# EAGLE design KeepUntil-v1.0.1 (EAGLE 7.5.0)
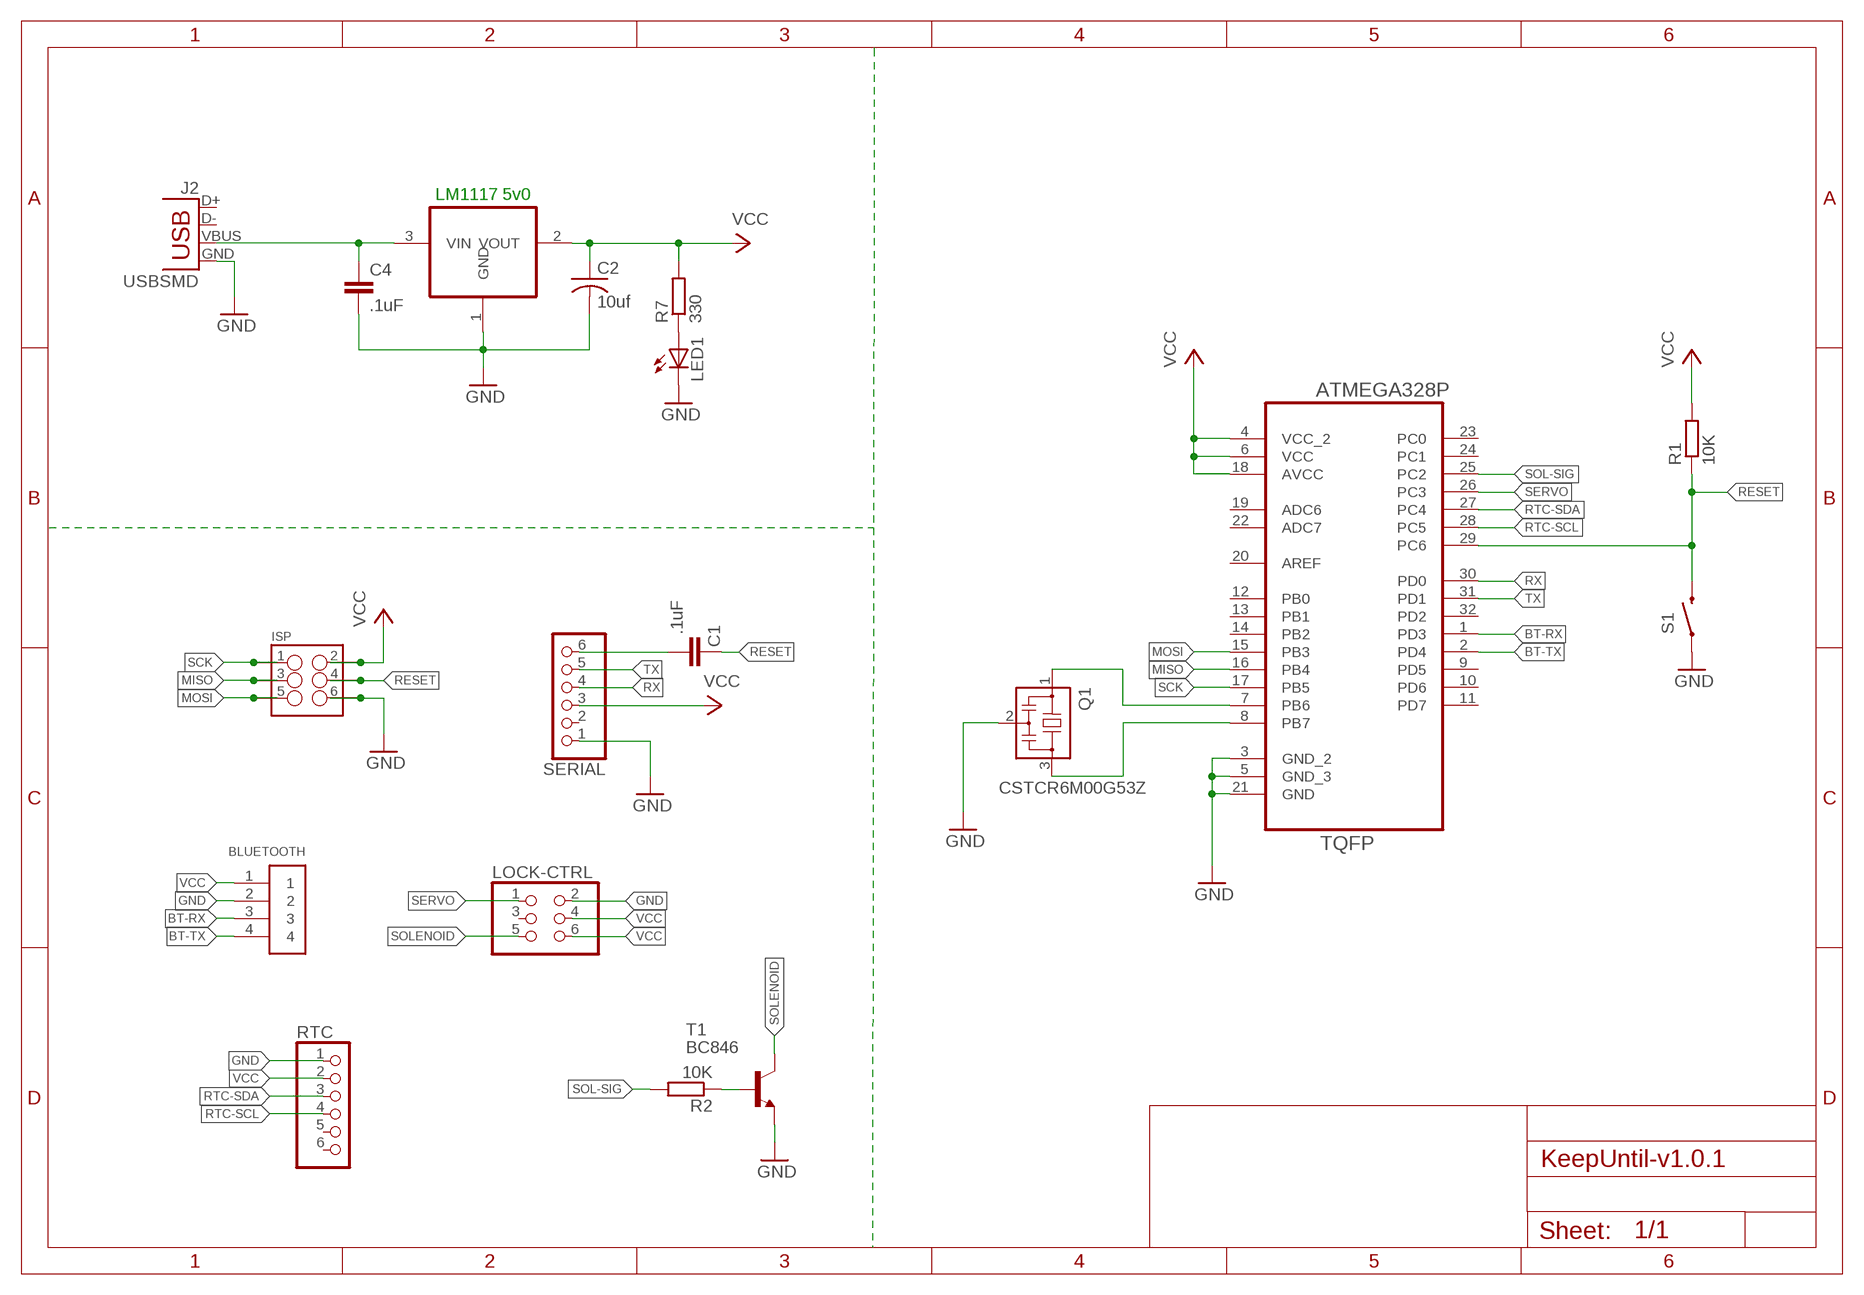
[diagram p0: schematic, sheet 1]

## Parts
BLUETOOTH  1X4-CLEANBIG  [1X04-CLEANBIG]
C1  .1uF  C-EUC0805  [C0805]
C2  10uf  C-USC1206  [C1206]
C4  .1uF  C-EUC0805  [C0805]
IC2  REG1117  [SOT223]
ISP  M03X2SHROUD  [2X3-SHROUDED]
J2  USBSMD  [USB-MINIB]
LED1  LEDSMT1206  [1206]
LOCK-CTRL  PINHD-2X3  [2X03]
Q1  CSTCR6M00G53Z  [CSTCR6M]
R1  10K  R-EU_R0805  [R0805]
R2  10K  R-EU_R0805  [R0805]
R7  330  R-EU_R0805  [R0805]
RTC  PINHD-1X6CLEAN  [1X06-CLEAN]
S1  SWITCH-MOMENTARY-2SMD-1101NE  [TACTILE-SWITCH-1101NE]
SERIAL  PINHD-1X6CLEAN  [1X06-CLEAN]
T1  BC846  [SOT23]
U1  ATMEGA328P-AU  [QFP80P900X900X120-32N]

## Nets
BT-RX: BLUETOOTH.3 U1.1(PD3)
BT-TX: BLUETOOTH.4 U1.2(PD4)
GND: BLUETOOTH.2 C2.2 C4.2 IC2.1(GND) ISP.6 J2.GND LED1.C LOCK-CTRL.2 Q1.2 RTC.1 S1.1 SERIAL.1 T1.2(E) U1.3(GND_2) U1.5(GND_3) U1.21(GND)
MISO: ISP.3 U1.16(PB4)
MOSI: ISP.5 U1.15(PB3)
N$1: Q1.1 U1.7(PB6)
N$2: Q1.3 U1.8(PB7)
N$3: R2.1 T1.1(B)
N$4: C4.1 IC2.3(VIN) J2.VBUS
N$7: LED1.A R7.1
N$17: C1.2 SERIAL.6
RESET: C1.1 ISP.4 R1.1 S1.2 U1.29(PC6)
RTC-SCL: RTC.4 U1.28(PC5)
RTC-SDA: RTC.3 U1.27(PC4)
RX: SERIAL.4 U1.30(PD0)
SCK: ISP.1 U1.17(PB5)
SERVO: LOCK-CTRL.1 U1.26(PC3)
SOL-SIG: R2.2 U1.25(PC2)
SOLENOID: LOCK-CTRL.5 T1.3(C)
TX: SERIAL.5 U1.31(PD1)
VCC: BLUETOOTH.1 C2.1 IC2.2(VOUT) ISP.2 LOCK-CTRL.4 LOCK-CTRL.6 R1.2 R7.2 RTC.2 SERIAL.3 U1.4(VCC_2) U1.6(VCC) U1.18(AVCC)
Unconnected: J2.D+ J2.D- LOCK-CTRL.3 RTC.5 RTC.6 SERIAL.2 U1.9(PD5) U1.10(PD6) U1.11(PD7) U1.12(PB0) U1.13(PB1) U1.14(PB2) U1.19(ADC6) U1.20(AREF) U1.22(ADC7) U1.23(PC0) U1.24(PC1) U1.32(PD2)

## Notes on the sheet
- LM1117 5v0

## Library data of the parts
BLUETOOTH = adafruit:1X4: 4-pin connector
C1 C4 = resistor:C-EU: CAPACITOR, European symbol
C2 = resistor:C-US: CAPACITOR, American symbol
IC2 = burr-brown:REG1117: 800mA and 1A Low Dropout (LDO) Positive Regulator 1.8V, 2.5V, 2.85V, 3.3V, 5V, and Adj; MPN: LM1117 3v3; OC_FARNELL: 1097566; OC_NEWARK: 14P6981
ISP = SparkFun-Connectors:M03X2: 2x3 .1" header. Shrouded, with keying- CONN-10681 SMT- CONN-11415 Pogo pins- HW-11044; PROD_ID: CONN-10681
J2 = SparkFun-Connectors:USB: USB Connectors USB-B-PTH is fully proven SKU : PRT-00139/CONN-08278 USB-miniB is fully proven SKU : PRT-00587 USB-A-PCB is untested. USB-A-H is throughly reviewed, but untested. Spark Fun Electronics SKU : PRT-00437 USB-B-SMT is throughly reviewed, but untested. Needs silkscreen touching up. USB-A-S has not been used/tested USB-MB-H has not been used/tested USB-MICROB has been used. CONN-09505; PROD_ID: CONN-08193
LED1 = led:LED: LED OSRAM: - CHIPLED LG R971, LG N971, LY N971, LG Q971, LY Q971, LO R971, LY R971 LH N974, LH R974 LS Q976, LO Q976, LY Q976 LO Q996 - Hyper CHIPLED LW Q18S LB Q993, LB Q99A, LB R99A - SideLED LS A670, LO A670, LY A670, LG A670, LP A670 LB A673, LV A673, LT A673, LW A673 LH A674 LY A675 LS A676, LA A676, LO A676, LY A676, LW A676 LS A679, LY A679, LG A679 - Hyper Micro SIDELED® LS Y876, LA Y876, LO Y876, LY Y876 LT Y87S - SmartLED LW L88C, LW L88S LB L89C, LB L89S, LG L890 LS L89K, LO L89K, LY L89K LS L896, LA L896, LO L896, LY L896 - TOPLED LS T670, LO T670, LY T670, LG T670, LP T670 LSG T670, LSP T670, LSY T670, LOP T670, LYG T670 LG T671, LOG T671, LSG T671 LB T673, LV T673, LT T673, LW T673 LH T674 LS T676, LA T676, LO T676, LY T676, LB T676, LH T676, LSB T676, LW T676 LB T67C, LV T67C, LT T67C, LS T67K, LO T67K, LY T67K, LW E67C LS E67B, LA E67B, LO E67B, LY E67B, LB E67C, LV E67C, LT E67C LW T67C LS T679, LY T679, LG T679 LS T770, LO T770, LY T770, LG T770, LP T770 LB T773, LV T773, LT T773, LW T773 LH T774 LS E675, LA E675, LY E675, LS T675 LS T776, LA T776, LO T776, LY T776, LB T776 LHGB T686 LT T68C, LB T68C - Hyper Mini TOPLED® LB M676 - Mini TOPLED Santana® LG M470 LS M47K, LO M47K, LY M47K Source: http://www.osram.convergy.de LUXEON: - LUMILED® LXK2-PW12-R00, LXK2-PW12-S00, LXK2-PW14-U00, LXK2-PW14-V00 LXK2-PM12-R00, LXK2-PM12-S00, LXK2-PM14-U00 LXK2-PE12-Q00, LXK2-PE12-R00, LXK2-PE12-S00, LXK2-PE14-T00, LXK2-PE14-U00 LXK2-PB12-K00, LXK2-PB12-L00, LXK2-PB12-M00, LXK2-PB14-N00, LXK2-PB14-P00, LXK2-PB14-Q00 LXK2-PR12-L00, LXK2-PR12-M00, LXK2-PR14-Q00, LXK2-PR14-R00 LXK2-PD12-Q00, LXK2-PD12-R00, LXK2-PD12-S00 LXK2-PH12-R00, LXK2-PH12-S00 LXK2-PL12-P00, LXK2-PL12-Q00, LXK2-PL12-R00 Source: www.luxeon.com KINGBRIGHT: KA-3528ASYC Source: www.kingbright.com
LOCK-CTRL = pinhead:PINHD-2X3: PIN HEADER
Q1 = murata-filter:CSTCR: Resonator Source: murata.co.jp; MPN: CSTCR6M00G53-R0; OC_FARNELL: 1170434; OC_NEWARK: 25M8759
R1 R2 R7 = resistor:R-EU_: RESISTOR, European symbol
RTC SERIAL = adafruit:PINHD-1X6: PIN HEADER
S1 = SparkFun-Electromechanical:SWITCH-MOMENTARY-2: Various NO switches- pushbuttons, reed, etc; PROD_ID: SWCH-00815
T1 = transistor:BC846: NPN TRANSISTOR
U1 = Ava:ATMEGA328P-AU; DESCRIPTION: 8-bit Microcontroller with In-System Programmable Flash; MPN: ATMEGA328P-AU; OC_FARNELL: 1715486; OC_NEWARK: 14R4631; PACKAGE: TQFP-32; SUPPLIER: Atmel

## Board
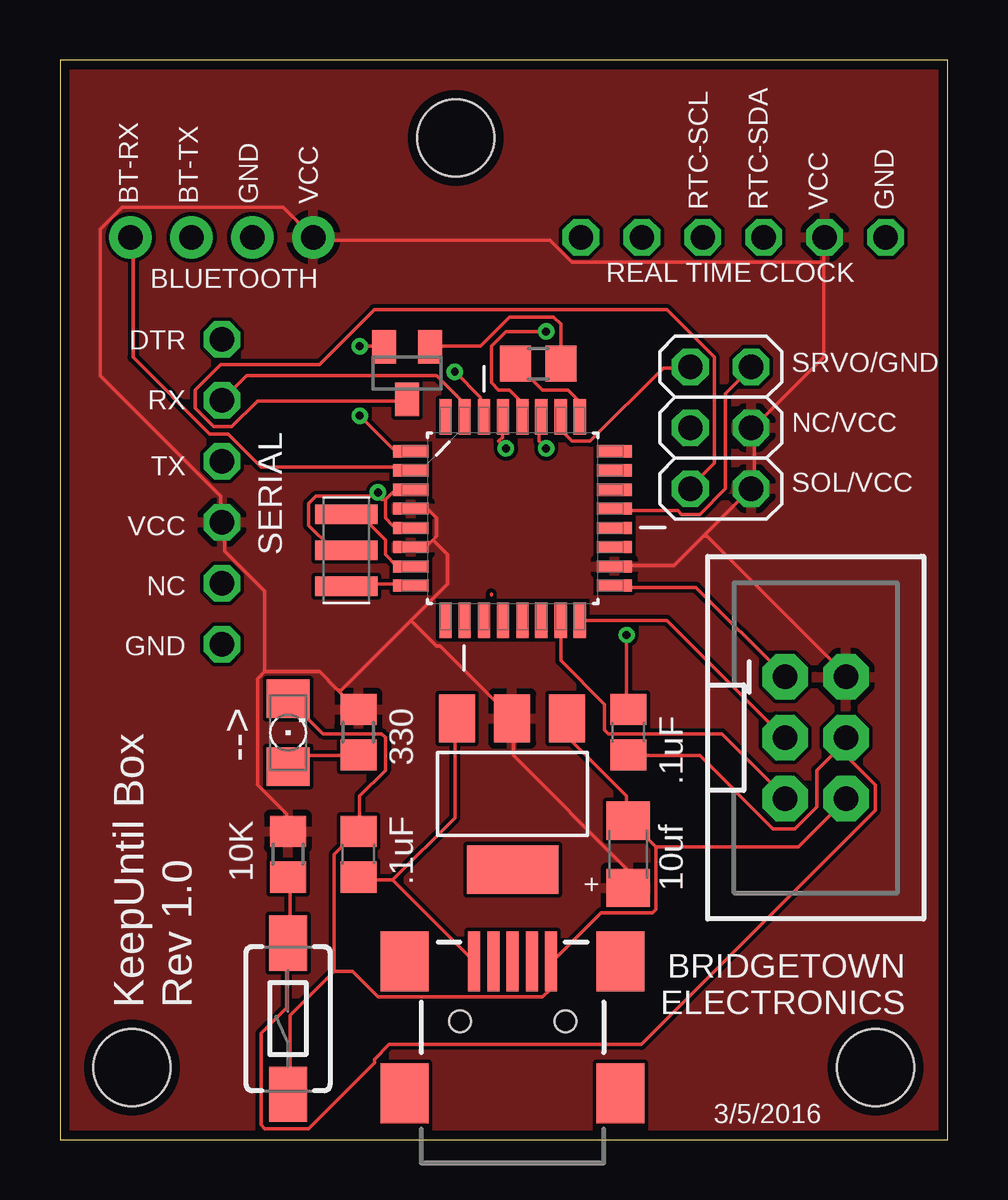
[diagram p1: board, top side]
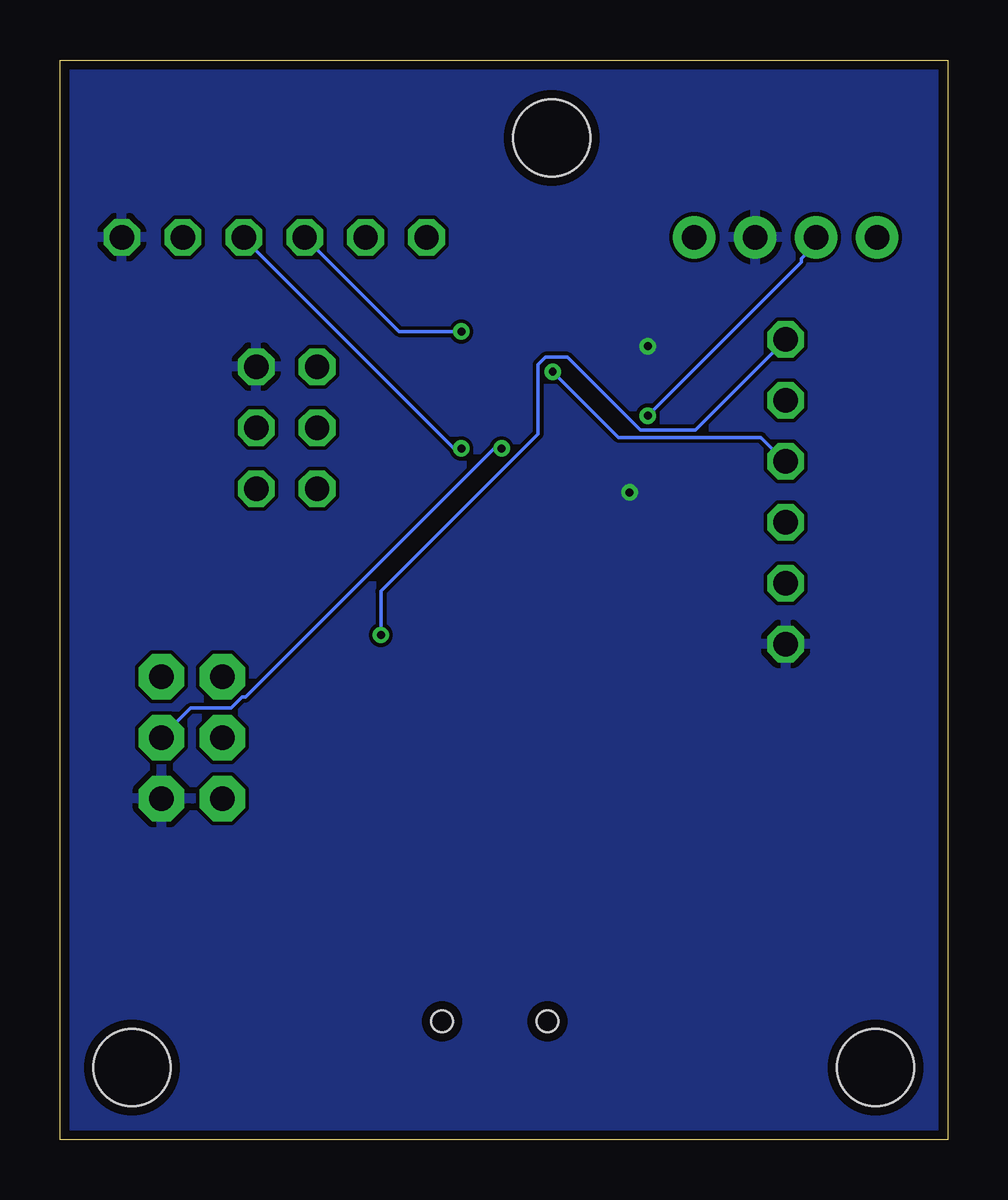
[diagram p2: board, bottom side, seen from below]

Size 37 x 45 mm. Coordinates in mm from the lower left corner, seen from the top.
Outline: 0,0 37,0 37,45 0,45 0,0
Copper layers (1*16): Top 0.0356mm / dielectric 1.5011mm / Bottom 0.0356mm
Design rules "oshpark-2layer": minimum track width 6mil, minimum drill 13mil, track to track 6mil, track to pad 6mil, pad to pad 6mil, via to via 6mil, smd to smd 6mil, copper to edge 15mil, drill to drill 6mil, minimum pad ring 7mil, minimum via ring 7mil, stop-mask expansion 2.5mil, vias tented up to drill 0mil, thermal gap 10mil
Holes 3.2 mm at 3,3 16.5,41.75 34,3

### Footprints (pad centres in the part's own frame; a part is rotated, then mirrored left to right if it is on the bottom)
1X04-CLEANBIG = drill 1.016 pad 1.778: 1 -3.81,0; 2 -1.27,0; 3 1.27,0; 4 3.81,0
C0805 = smd 1.3 x 1.5: 1 -0.95,0; 2 0.95,0
C1206 = smd 1.6 x 1.8: 1 -1.4,0; 2 1.4,0
SOT223 = smd 1.499 x 2.007: 1 -2.261,-3.15; 2 0.025,-3.15; 3 2.311,-3.15 | smd 3.81 x 2.007: 4 0,3.15
2X3-SHROUDED = drill 1.016 pad 1.88 octagon: 1 -1.27,2.54; 2 1.27,2.54; 3 -1.27,0; 4 1.27,0; 5 -1.27,-2.54; 6 1.27,-2.54
USB-MINIB = smd 2.5 x 0.5: D+ 2.5,0; D- 2.5,0.8; GND 2.5,-1.6; ID 2.5,-0.8; VBUS 2.5,1.6 | smd 2.5 x 2: MTN1 -3,4.5; MTN2 2.5,4.5; MTN3 -3,-4.5; MTN4 2.5,-4.5 | hole 0.9: 0,2.2; 0,-2.2
1206 = smd 1.6 x 1.803: A -1.422,0; C 1.422,0
2X03 = drill 1.016 octagon: 1 -2.54,-1.27; 2 -2.54,1.27; 3 0,-1.27; 4 0,1.27; 5 2.54,-1.27; 6 2.54,1.27
CSTCR6M = smd 0.8 x 2.6: 1 -1.5,0; 2 0,0; 3 1.5,0
R0805 = smd 1.3 x 1.5: 1 -0.95,0; 2 0.95,0
1X06-CLEAN = drill 1.016 octagon: 1 -6.35,0; 2 -3.81,0; 3 -1.27,0; 4 1.27,0; 5 3.81,0; 6 6.35,0
TACTILE-SWITCH-1101NE = smd 2.3 x 1.6: 1 -3.15,0; 2 3.15,0
SOT23 = smd 1 x 1.4: 1 -0.95,-1.1; 2 0.95,-1.1; 3 0,1.1
QFP80P900X900X120-32N = smd 1.473 x 0.508: 1 -4.242,2.794; 2 -4.242,2.007; 3 -4.242,1.194; 4 -4.242,0.406; 5 -4.242,-0.406; 6 -4.242,-1.194; 7 -4.242,-2.007; 8 -4.242,-2.794; 17 4.242,-2.794; 18 4.242,-2.007; 19 4.242,-1.194; 20 4.242,-0.406; 21 4.242,0.406; 22 4.242,1.194; 23 4.242,2.007; 24 4.242,2.794 | smd 0.508 x 1.473: 9 -2.794,-4.242; 10 -2.007,-4.242; 11 -1.194,-4.242; 12 -0.406,-4.242; 13 0.406,-4.242; 14 1.194,-4.242; 15 2.007,-4.242; 16 2.794,-4.242; 25 2.794,4.242; 26 2.007,4.242; 27 1.194,4.242; 28 0.406,4.242; 29 -0.406,4.242; 30 -1.194,4.242; 31 -2.007,4.242; 32 -2.794,4.242

### Placement (x,y rotation side)
BLUETOOTH  6.75,37.61 180 top
C1  23.69,16.98 90 top
C2  23.69,11.89 90 top
C4  12.44,11.89 90 top
IC2  18.87,14.4 180 top
ISP  31.5,16.75 0 top
J2  18.87,4.93 90 top
LED1  9.51,16.96 90 top
LOCK-CTRL  27.55,29.67 270 top
Q1  11.94,24.56 270 top
R1  9.51,11.89 90 top
R2  19.94,32.34 180 top
R7  12.44,16.98 90 top
RTC  28.07,37.61 180 top
S1  9.51,5.04 90 top
SERIAL  6.75,27 90 top
T1  14.47,31.95 180 top
U1  18.87,25.89 0 top

### Tracks (layer width: path | path; a pad name or v marks a point on that pad's centre or on a via)
BT-RX  (via drill 0.33)
  Top 0.152: v12.5,30.18 13.87,28.8 14.48,28.8 U1.1
  Bottom 0.152: v12.5,30.18 6.1,36.58 6.1,36.73 5.33,37.49 BLUETOOTH.3
BT-TX
  Top 0.152: U1.2 14.48,28.04 8.38,28.04 7.01,29.41 6.25,29.41 3.05,32.61 3.05,37.49 BLUETOOTH.4
GND  (via drill 0.33)
  Top 0.152: LED1.C 9.6,18.29 10.97,16.92 13.41,16.92 13.56,16.76 13.56,15.39 12.5,14.33 12.5,12.95 C4.2 12.34,12.8 11.43,11.89 11.43,7.01 | 11.43,7.01 9.6,5.18 9.6,1.98 S1.1 | IC2.1 21.18,17.53 21.18,16.76 23.62,14.33 23.62,13.41 C2.2 23.77,13.26 24.84,12.19 | 24.84,12.19 24.84,9.6 24.69,9.45 22.55,9.45 20.57,7.47 J2.GND 20.42,7.32 20.42,6.25 20.12,5.94 13.26,5.94 12.19,7.01 11.43,7.01 | 13.56,26.67 13.56,25.91 13.87,25.6 14.48,25.6 U1.5 | 13.56,26.67 13.87,26.98 14.48,26.98 U1.3 | 13.56,26.67 13.41,26.67 13.26,26.82 | 13.26,26.82 10.67,26.82 10.36,26.52 10.36,25.6 11.28,24.69 11.89,24.69 Q1.2 | v12.5,33.07 13.41,33.07 T1.2 | U1.21 23.16,26.21 25.76,26.21 25.91,26.06 26.67,26.06 27.74,27.13 27.74,31.09 28.8,32.16 LOCK-CTRL.2 | v13.26,26.98 13.26,26.82 | 24.84,12.19 30.79,12.19 32.77,14.17 ISP.6
  pour Bottom: 0,0 37,0 37,45 0,45
MISO
  Top 0.152: U1.16 21.79,21.64 25.3,21.64 30.18,16.76 ISP.3
MOSI
  Top 0.152: U1.15 20.88,19.96 22.71,18.14 22.71,17.07 22.86,16.92 27.58,16.92 30.18,14.33 ISP.5
N$1
  Top 0.152: U1.7 14.48,23.93 14.02,23.93 13.56,24.38 13.56,24.99 12.65,25.91 12.04,25.91 Q1.1
N$2
  Top 0.152: U1.8 14.48,23.16 12.04,23.16 Q1.3
N$3
  Top 0.152: T1.1 15.54,33.07 17.53,33.07 18.75,34.29 20.57,34.29 20.88,33.98 20.88,32.46 R2.1
N$4
  Top 0.152: 13.87,10.82 12.5,10.82 C4.1 | 13.87,10.82 17.22,7.47 J2.VBUS | 13.87,10.82 16.46,13.41 16.46,17.53 IC2.3
N$5
  Top 0.152: 17.98,22.71 17.98,22.74
N$7
  Top 0.152: R7.1 12.34,16 10.06,16 9.6,15.54 LED1.A
N$17  (via drill 0.33)
  Top 0.152: v23.62,21.03 23.62,17.98 C1.2
  Bottom 0.152: v23.62,21.03 23.62,22.86 17.07,29.41 17.07,32.31 16.76,32.61 15.85,32.61 12.8,29.57 10.52,29.57 6.86,33.22 SERIAL.6
RESET  (via drill 0.33)
  Top 0.152: R1.1 9.6,10.82 9.6,8.23 S1.2 9.45,8.08 9.45,5.49 8.38,4.42 8.38,0.61 8.53,0.46 10.36,0.46 13.11,3.2 13.11,3.35 13.72,3.96 24.23,3.96 33.98,13.72 33.98,14.78 32.46,16.31 | v18.59,28.8 18.29,29.11 18.44,29.26 18.44,30.02 U1.29 | 32.46,16.31 32.77,16.61 ISP.4 32.46,16.31 | 32.46,16.31 31.55,15.39 31.55,13.87 30.63,12.95 29.72,12.95 26.67,16 23.77,16 C1.1
  Bottom 0.152: v18.59,28.8 18.9,28.8 29.26,18.44 29.41,18.44 29.87,17.98 31.55,17.98 32.77,16.76 ISP.4
RTC-SCL  (via drill 0.33)
  Top 0.152: v20.27,33.68 18.59,33.68 17.98,33.07 17.98,31.55 18.29,31.24 18.75,31.24 19.2,30.79 19.2,30.18 U1.28
  Bottom 0.152: v20.27,33.68 22.86,33.68 26.67,37.49 RTC.4
RTC-SDA  (via drill 0.33)
  Top 0.152: v20.27,28.8 19.96,29.11 19.96,30.02 U1.27
  Bottom 0.152: v20.27,28.8 20.57,28.8 29.26,37.49 RTC.3
RX  (via drill 0.33)
  Top 0.152: v16.46,32 17.53,30.94 17.53,30.18 U1.30
  Bottom 0.152: v16.46,32 13.72,29.26 7.77,29.26 6.86,28.35 SERIAL.4
SCK
  Top 0.152: U1.17 23.16,23.01 26.52,23.01 30.18,19.36 ISP.1
SERVO
  Top 0.152: U1.26 20.88,30.02 20.88,29.57 21.34,29.11 22.1,29.11 25.15,32.16 26.21,32.16 LOCK-CTRL.1
SOL-SIG
  Top 0.152: U1.25 21.64,30.18 21.64,30.79 21.18,31.24 20.12,31.24 19.05,32.31 R2.2
SOLENOID
  Top 0.152: T1.3 14.33,30.79 8.23,30.79 7.16,29.72 6.4,29.72 5.64,30.48 5.64,31.24 6.71,32.31 10.82,32.31 13.11,34.59 25.3,34.59 27.28,32.61 27.28,28.19 26.36,27.28 LOCK-CTRL.5
TX
  Top 0.152: U1.31 16.76,30.18 16.76,30.79 15.7,31.85 7.77,31.85 6.86,30.94 SERIAL.5
VCC
  Top 0.152: C2.1 23.62,10.52 23.62,11.28 18.9,16 18.9,17.53 IC2.2 18.75,17.68 15.85,20.57 15.7,20.57 14.63,21.64 | 15.54,24.99 15.7,25.15 15.7,25.91 15.39,26.21 14.63,26.21 U1.4 | 15.54,24.99 15.39,24.84 14.63,24.84 U1.6 | 8.53,19.51 8.23,19.2 8.23,14.78 9.45,13.56 9.45,12.95 R1.2 | 8.53,19.51 10.82,19.51 11.58,18.75 | 11.58,18.75 12.34,17.98 R7.2 | 15.54,24.99 16.15,24.38 16.15,23.16 14.63,21.64 | 14.63,21.64 11.73,18.75 11.58,18.75 | 8.53,19.51 8.53,22.86 6.86,24.54 6.86,25.6 SERIAL.3 6.71,25.76 6.71,26.82 1.68,31.85 1.68,37.95 2.59,38.86 9.3,38.86 10.52,37.64 BLUETOOTH.1 10.67,37.49 20.42,37.49 21.34,36.58 31.85,36.58 | 26.82,25.15 28.8,27.13 LOCK-CTRL.6 28.96,27.28 28.96,29.57 LOCK-CTRL.4 28.96,29.72 31.85,32.61 31.85,36.58 | 26.82,25.15 25.6,23.93 23.16,23.93 U1.18 | 31.85,36.58 31.85,37.49 RTC.2 | 26.82,25.15 26.98,25.15 32.77,19.36 ISP.2
  pour Top: 0,0 37,0 37,45 0,45

### Text on the board
tPlace: BT-RX | BT-TX | GND | VCC | RTC-SCL | RTC-SDA | VCC | GND | BLUETOOTH | REAL TIME CLOCK | DTR | SRVO/GND | RX | SERIAL | NC/VCC | TX | SOL/VCC | VCC | NC | GND | --> | + | BRIDGETOWN / ELECTRONICS | KeepUntil Box | Rev 1.0 | 3/5/2016